# EAGLE design mr_radar_trolley (EAGLE 6.1)
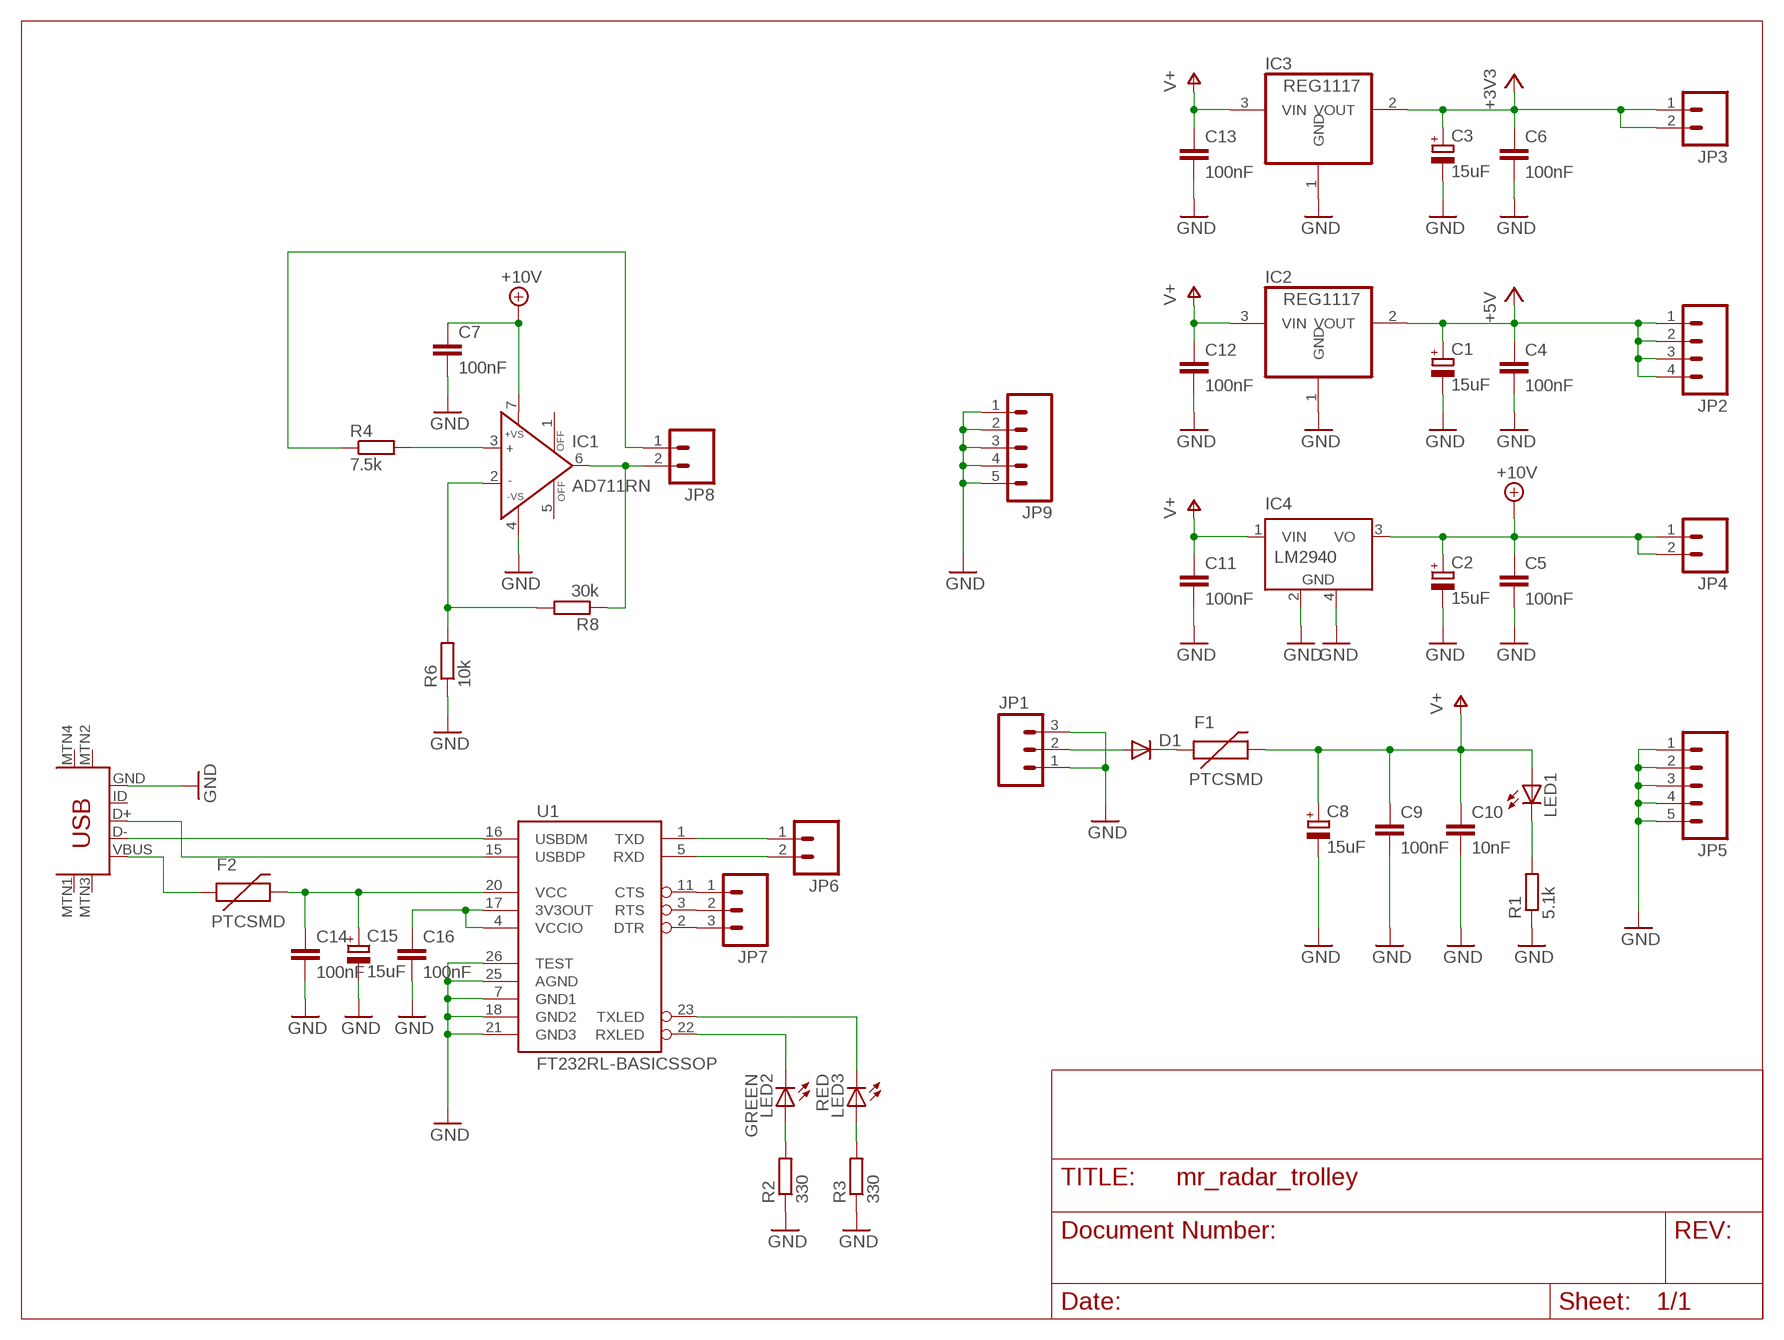
[diagram p0: schematic, sheet 1]

## Parts
C1  15uF  CPOL-EUB/3528-21R  [B/3528-21R]
C2  15uF  CPOL-EUB/3528-21R  [B/3528-21R]
C3  15uF  CPOL-EUB/3528-21R  [B/3528-21R]
C4  100nF  C-EUC0603  [C0603]
C5  100nF  C-EUC0603  [C0603]
C6  100nF  C-EUC0603  [C0603]
C7  100nF  C-EUC0603  [C0603]
C8  15uF  CPOL-EUB/3528-21R  [B/3528-21R]
C9  100nF  C-EUC0603  [C0603]
C10  10nF  C-EUC0603  [C0603]
C11  100nF  C-EUC0603  [C0603]
C12  100nF  C-EUC0603  [C0603]
C13  100nF  C-EUC0603  [C0603]
C14  100nF  C-EUC0603  [C0603]
C15  15uF  CPOL-EUB/3528-21R  [B/3528-21R]
C16  100nF  C-EUC0603  [C0603]
D1  DIODE-SMC  [SMC]
F1  PTCSMD  [PTC-1206]
F2  PTCSMD  [PTC-1206]
IC1  AD711RN  [SO8]
IC2  REG1117  [SOT223]
IC3  REG1117  [SOT223]
IC4  LM2940  LM2936MP-5.0  [SOT223]
JP1  M03SCREW  [SCREWTERMINAL-3.5MM-3]
JP2  M04LOCK  [1X04_LOCK]
JP3  M02PTH  [1X02]
JP4  M02PTH  [1X02]
JP5  M05LOCK  [1X05_LOCK]
JP6  M02PTH  [1X02]
JP7  M03PTH  [1X03]
JP8  M02PTH  [1X02]
JP9  M05LOCK  [1X05_LOCK]
LED1  LEDCHIPLED_1206  [CHIPLED_1206]
LED2  GREEN  LEDCHIPLED_1206  [CHIPLED_1206]
LED3  RED  LEDCHIPLED_1206  [CHIPLED_1206]
R1  5.1k  R-EU_R0603  [R0603]
R2  330  R-EU_M0805  [M0805]
R3  330  R-EU_M0805  [M0805]
R4  7.5k  R-EU_R0603  [R0603]
R6  10k  R-EU_R0603  [R0603]
R8  30k  R-EU_R0603  [R0603]
U1  FT232RL-BASICSSOP  [SSOP28DB]
U$1  USB-MINIB-5PIN  [USB-MINIB]

## Nets
+3V3: C3.+ C6.1 IC3.2(VOUT) JP3.1 JP3.2
+5V: C1.+ C4.1 IC2.2(VOUT) JP2.1 JP2.2 JP2.3 JP2.4
+10V: C2.+ C5.1 C7.1 IC1.7(+VS) IC4.3(VO) JP4.1 JP4.2
GND: C1.- C2.- C3.- C4.2 C5.2 C6.2 C7.2 C8.- C9.2 C10.2 C11.2 C12.2 C13.2 C14.2 C15.- C16.2 IC1.4(-VS) IC2.1(GND) IC3.1(GND) IC4.2(GND) IC4.4(GND) JP1.1 JP1.3 JP5.1 JP5.2 JP5.3 JP5.4 JP5.5 JP9.1 JP9.2 JP9.3 JP9.4 JP9.5 R1.1 R2.1 R3.1 R6.1 U1.7(GND1) U1.18(GND2) U1.21(GND3) U1.25(AGND) U1.26(TEST) U$1.GND
N$1: D1.C F1.1
N$2: D1.A JP1.2
N$3: LED1.C R1.2
N$4: F2.1 U$1.VBUS
N$5: U1.16(USBDM) U$1.D-
N$6: U1.15(USBDP) U$1.D+
N$7: C16.1 U1.4(VCCIO) U1.17(3V3OUT)
N$8: JP6.1 U1.1(TXD)
N$9: JP6.2 U1.5(RXD)
N$10: C14.1 C15.+ F2.2 U1.20(VCC)
N$11: LED3.C U1.23(TXLED)
N$12: LED2.C U1.22(RXLED)
N$13: JP7.1 U1.11(CTS)
N$14: JP7.2 U1.3(RTS)
N$15: JP7.3 U1.2(DTR)
N$16: IC1.2(IN-) R6.2 R8.2
N$17: IC1.6(OUT) JP8.2 R8.1
N$18: JP8.1 R4.1
N$19: IC1.3(IN+) R4.2
V+: C8.+ C9.1 C10.1 C11.1 C12.1 C13.1 F1.2 IC2.3(VIN) IC3.3(VIN) IC4.1(VIN) LED1.A
V+1: LED2.A R2.2
V+2: LED3.A R3.2
Unconnected: IC1.1(OFF) IC1.5(OFF) U$1.ID U$1.MTN1(MTN2) U$1.MTN2(MTN3) U$1.MTN3(MTN1) U$1.MTN4

## Library data of the parts
C1-C3 C8 C15 = rcl:CPOL-EU: POLARIZED CAPACITOR, European symbol
C4-C7 C9-C14 C16 = resistor:C-EU: CAPACITOR, European symbol
D1 = diode:DIODE-: DIODE
F1 F2 = SparkFun-PowerIC:PTC: Resettable Fuse PTC Resettable Fuse. Spark Fun Electronics SKU : COM-08357
IC1 = analog-devices:AD711: Precision, Low Cost, High Speed, BiFET Op Amp Source: http://www.analog.com/static/imported-files/data_sheets/AD711.pdf; MF: ALTERA CORPORATION; MPN: AD711KRZ; OC_FARNELL: 9426396; OC_NEWARK: 59K4541
IC2 IC3 = burr-brown:REG1117: 800mA and 1A Low Dropout (LDO) Positive Regulator 1.8V, 2.5V, 2.85V, 3.3V, 5V, and Adj; MPN: REG1117; OC_FARNELL: 1097566; OC_NEWARK: 14P6981
IC4 = national-semiconductor:LM2936MP?*: Ultra-Low Quiescent Current LDO Voltage Regulator Source: Data sheet <http://www.national.com/ds/LM/LM2936.pdf>; MF: NATIONAL SEMICONDUCTOR; MPN: LM2936MP-5.0/NOPB; OC_FARNELL: 1469063; OC_NEWARK: 41K4524
JP1 JP7 = SparkFun-Connectors:M03: Header 3 Standard 3-pin 0.1" header. Use with straight break away headers (SKU : PRT-00116), right angle break away headers (PRT-00553), swiss pins (PRT-00743), machine pins (PRT-00117), and female headers (PRT-00115). Molex polarized connector foot print use with SKU : PRT-08232 with associated crimp pins and housings.
JP2 = SparkFun-Connectors:M04: Header 4 Standard 4-pin 0.1" header. Use with straight break away headers (SKU : PRT-00116), right angle break away headers (PRT-00553), swiss pins (PRT-00743), machine pins (PRT-00117), and female headers (PRT-00115). Molex polarized connector foot print use with SKU : PRT-08231 with associated crimp pins and housings. 1MM SMD Version SKU: PRT-10208
JP3 JP4 JP6 JP8 = SparkFun-Connectors:M02: Header 2 Standard 2-pin 0.1" header. Use with straight break away headers (SKU : PRT-00116), right angle break away headers (PRT-00553), swiss pins (PRT-00743), machine pins (PRT-00117), and female headers (PRT-00115). Molex polarized connector foot print use with SKU : PRT-08233 with associated crimp pins and housings.
JP5 JP9 = SparkFun-Connectors:M05: Header 5 Standard 5-pin 0.1" header. Use with straight break away headers (SKU : PRT-00116), right angle break away headers (PRT-00553), swiss pins (PRT-00743), machine pins (PRT-00117), and female headers (PRT-00115). Molex polarized connector foot print use with SKU : PRT-08230 with associated crimp pins and housings.
LED1-LED3 = led:LED: LED OSRAM: - CHIPLED LG R971, LG N971, LY N971, LG Q971, LY Q971, LO R971, LY R971 LH N974, LH R974 LS Q976, LO Q976, LY Q976 LO Q996 - Hyper CHIPLED LW Q18S LB Q993, LB Q99A, LB R99A - SideLED LS A670, LO A670, LY A670, LG A670, LP A670 LB A673, LV A673, LT A673, LW A673 LH A674 LY A675 LS A676, LA A676, LO A676, LY A676, LW A676 LS A679, LY A679, LG A679 - Hyper Micro SIDELED® LS Y876, LA Y876, LO Y876, LY Y876 LT Y87S - SmartLED LW L88C, LW L88S LB L89C, LB L89S, LG L890 LS L89K, LO L89K, LY L89K LS L896, LA L896, LO L896, LY L896 - TOPLED LS T670, LO T670, LY T670, LG T670, LP T670 LSG T670, LSP T670, LSY T670, LOP T670, LYG T670 LG T671, LOG T671, LSG T671 LB T673, LV T673, LT T673, LW T673 LH T674 LS T676, LA T676, LO T676, LY T676, LB T676, LH T676, LSB T676, LW T676 LB T67C, LV T67C, LT T67C, LS T67K, LO T67K, LY T67K, LW E67C LS E67B, LA E67B, LO E67B, LY E67B, LB E67C, LV E67C, LT E67C LW T67C LS T679, LY T679, LG T679 LS T770, LO T770, LY T770, LG T770, LP T770 LB T773, LV T773, LT T773, LW T773 LH T774 LS E675, LA E675, LY E675, LS T675 LS T776, LA T776, LO T776, LY T776, LB T776 LHGB T686 LT T68C, LB T68C - Hyper Mini TOPLED® LB M676 - Mini TOPLED Santana® LG M470 LS M47K, LO M47K, LY M47K Source: http://www.osram.convergy.de LUXEON: - LUMILED® LXK2-PW12-R00, LXK2-PW12-S00, LXK2-PW14-U00, LXK2-PW14-V00 LXK2-PM12-R00, LXK2-PM12-S00, LXK2-PM14-U00 LXK2-PE12-Q00, LXK2-PE12-R00, LXK2-PE12-S00, LXK2-PE14-T00, LXK2-PE14-U00 LXK2-PB12-K00, LXK2-PB12-L00, LXK2-PB12-M00, LXK2-PB14-N00, LXK2-PB14-P00, LXK2-PB14-Q00 LXK2-PR12-L00, LXK2-PR12-M00, LXK2-PR14-Q00, LXK2-PR14-R00 LXK2-PD12-Q00, LXK2-PD12-R00, LXK2-PD12-S00 LXK2-PH12-R00, LXK2-PH12-S00 LXK2-PL12-P00, LXK2-PL12-Q00, LXK2-PL12-R00 Source: www.luxeon.com KINGBRIGHT: KA-3528ASYC Source: www.kingbright.com
R1 R4 R6 R8 = rcl:R-EU_: RESISTOR, European symbol
R2 R3 = resistor:R-EU_: RESISTOR, European symbol
U1 = SparkFun-DigitalIC:FT232RL-BASIC: USB UART This is the simplified version of the FT232RL unit. Only what you need, nothing you don't. Spark Fun Electronics SKU : COM-00650
U$1 = SparkFun-Connectors:USB-MINIB: Mini-USB "B" connector with 5th pin broken out. Created new symbol breaking out 5th "ID" pin in mini/micro USB connector spec. See: http://en.wikipedia.org/wiki/Mini_usb#Cables. Uses same footprint as 4-pin symbol. Also added pins to connect to mounting / shield pads if required (probably not generally needed as signals aren't shielded once they leave the connector).

## Board
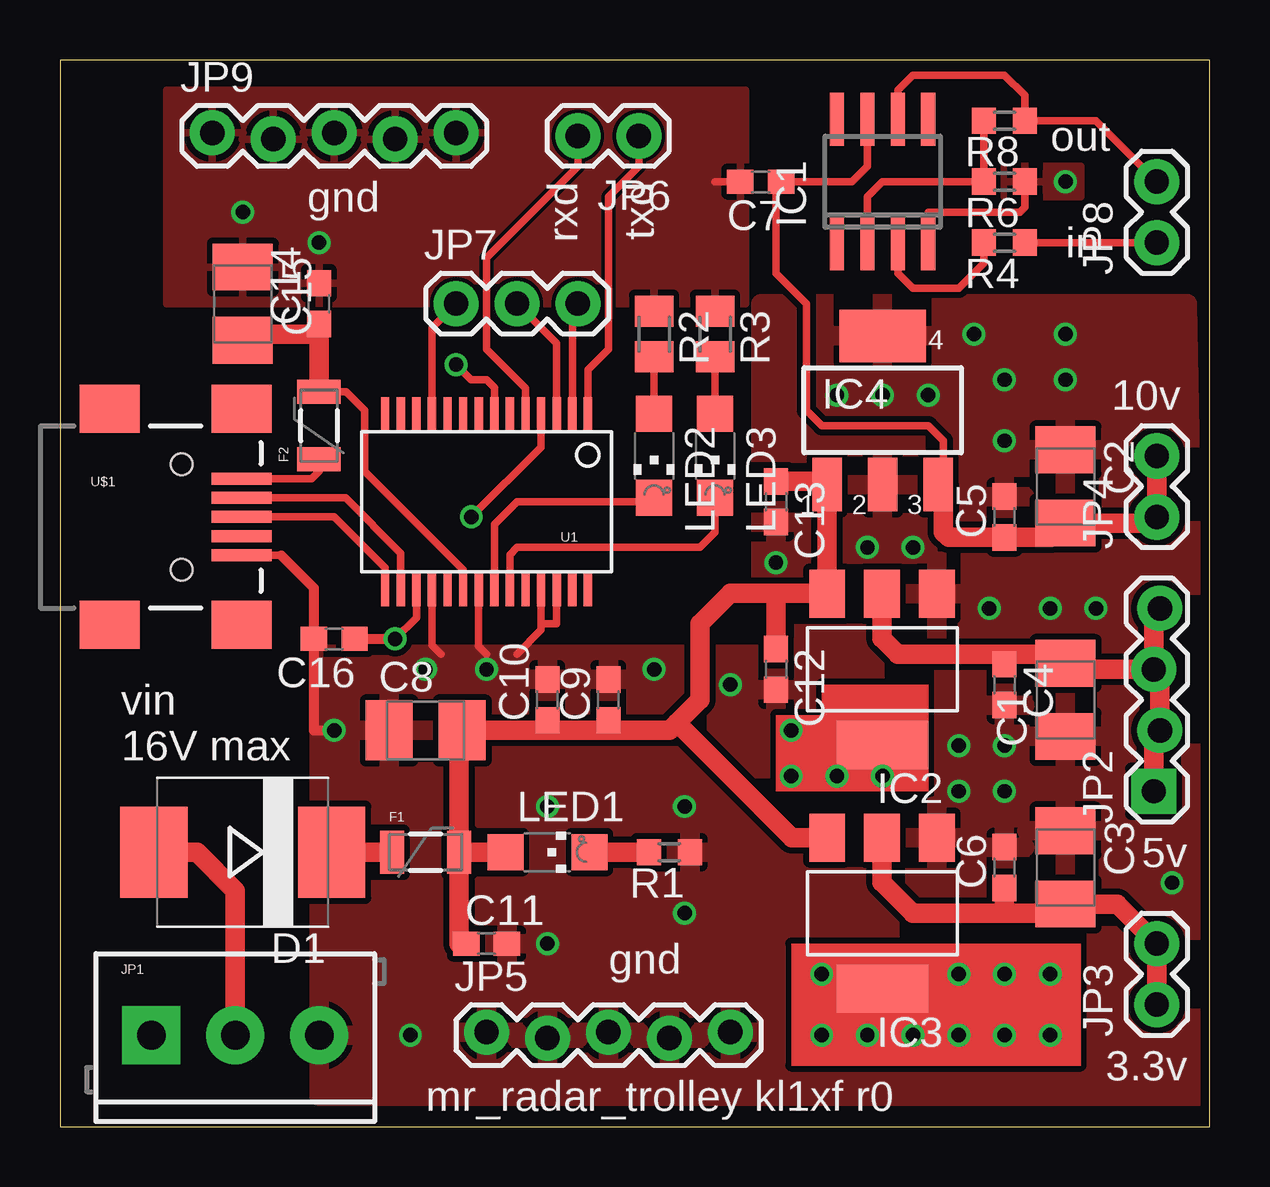
[diagram p1: board, top side]
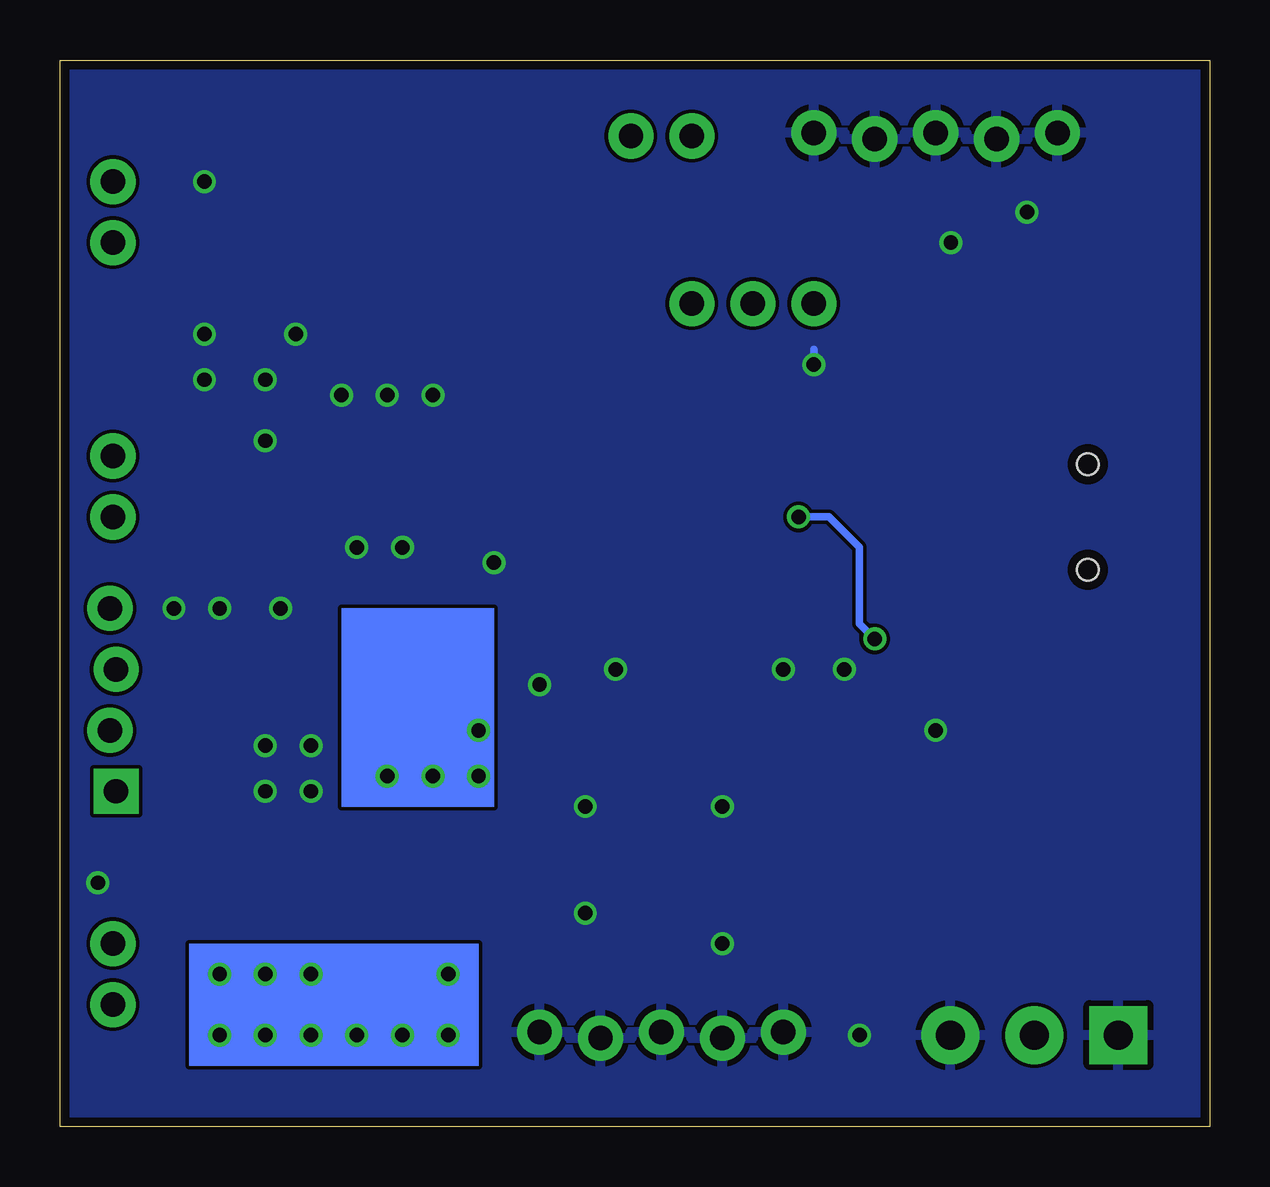
[diagram p2: board, bottom side, seen from below]

Size 47.93 x 44.44 mm. Coordinates in mm from the lower left corner, seen from the top.
Outline: 0,0 47.93,0 47.93,44.44 0,44.44 0,0
Copper layers (1*16): Top 0.0356mm / dielectric 1.5011mm / Bottom 0.0356mm
Design rules: minimum track width 6mil, minimum drill 13mil, track to track 6mil, track to pad 6mil, pad to pad 6mil, via to via 6mil, smd to smd 6mil, copper to edge 15mil, drill to drill 6mil, minimum pad ring 7mil, minimum via ring 7mil, stop-mask expansion 4mil, vias tented up to drill 0mil, thermal gap 10mil

### Footprints (pad centres in the part's own frame; a part is rotated, then mirrored left to right if it is on the bottom)
B/3528-21R = smd 1.95 x 2.5: + 1.525,0; - -1.525,0
C0603 = smd 1.1 x 1: 1 -0.85,0; 2 0.85,0
SMC = smd 2.8 x 3.8: A 3.7,0; C -3.7,0
PTC-1206 = smd 1 x 1.8: 1 -1.4,0; 2 1.4,0
SO8 = smd 0.6 x 2.2: 1 -1.905,-2.6; 2 -0.635,-2.6; 3 0.635,-2.6; 4 1.905,-2.6; 5 1.905,2.6; 6 0.635,2.6; 7 -0.635,2.6; 8 -1.905,2.6
SOT223 = smd 1.499 x 2.007: 1 -2.261,-3.15; 2 0.025,-3.15; 3 2.311,-3.15 | smd 3.81 x 2.007: 4 0,3.15
SOT223' = smd 1.219 x 2.235: 1 -2.311,-3.099; 2 0,-3.099; 3 2.311,-3.099 | smd 3.6 x 2.2: 4 0,3.099
SCREWTERMINAL-3.5MM-3 = drill 1.2 pad 2.413 square: 1 0,0 | drill 1.2 pad 2.413: 2 3.5,0; 3 7,0
1X04_LOCK = drill 1.016 pad 1.88 square: 1 0,0.127 | drill 1.016 pad 1.88: 2 2.54,-0.127; 3 5.08,0.127; 4 7.62,-0.127
1X02 = drill 1.016 pad 1.88: 1 0,0; 2 2.54,0
1X05_LOCK = drill 1.016 pad 1.88: 1 0,0.127; 2 2.54,-0.127; 3 5.08,0.127; 4 7.62,-0.127; 5 10.16,0.127
1X03 = drill 1.016 pad 1.88: 1 0,0; 2 2.54,0; 3 5.08,0
CHIPLED_1206 = smd 1.5 x 1.5: A 0,-1.75; C 0,1.75
R0603 = smd 1 x 1.1: 1 -0.85,0; 2 0.85,0
M0805 = smd 1.3 x 1.6: 1 -0.95,0; 2 0.95,0
SSOP28DB = smd 0.348 x 1.397: 1 -4.225,-3.656; 2 -3.575,-3.656; 3 -2.925,-3.656; 4 -2.275,-3.656; 5 -1.625,-3.656; 6 -0.975,-3.656; 7 -0.325,-3.656; 8 0.325,-3.656; 9 0.975,-3.656; 10 1.625,-3.656; 11 2.275,-3.656; 12 2.925,-3.656; 13 3.575,-3.656; 14 4.225,-3.656; 15 4.225,3.656; 16 3.575,3.656; 17 2.925,3.656; 18 2.275,3.656; 19 1.625,3.656; 20 0.975,3.656; 21 0.325,3.656; 22 -0.325,3.656; 23 -0.975,3.656; 24 -1.625,3.656; 25 -2.275,3.656; 26 -2.925,3.656; 27 -3.575,3.656; 28 -4.225,3.656
USB-MINIB = smd 2.5 x 0.5: D+ 2.5,0; D- 2.5,0.8; GND 2.5,-1.6; ID 2.5,-0.8; VBUS 2.5,1.6 | smd 2.5 x 2: MTN1 -3,4.5; MTN2 2.5,4.5; MTN3 -3,-4.5; MTN4 2.5,-4.5 | hole 0.9: 0,2.2; 0,-2.2

### Placement (x,y rotation side)
C1  41.91,17.78 90 top
C2  41.91,26.67 270 top
C3  41.91,10.79 270 top
C4  39.37,18.41 270 top
C5  39.37,25.4 90 top
C6  39.37,10.79 90 top
C7  29.21,39.37 180 top
C8  15.24,16.51 0 top
C9  22.86,17.78 90 top
C10  20.32,17.78 90 top
C11  17.78,7.62 0 top
C12  29.84,19.05 270 top
C13  29.84,26.04 270 top
C14  10.79,34.29 90 top
C15  7.62,34.29 270 top
C16  11.43,20.32 180 top
D1  7.62,11.43 180 top
F1  15.24,11.43 0 top
F2  10.79,29.21 90 top
IC1  34.29,39.37 0 top
IC2  34.29,19.05 180 top
IC3  34.29,8.89 180 top
IC4  LM2940  [SOT223']  34.29,29.84 0 top
JP1  3.81,3.81 0 top
JP2  45.72,13.97 90 top
JP3  45.72,5.08 90 top
JP4  45.72,25.4 90 top
JP5  17.78,3.81 0 top
JP6  24.13,41.27 180 top
JP7  16.51,34.29 0 top
JP8  45.72,36.83 90 top
JP9  6.35,41.27 0 top
LED1  20.32,11.43 270 top
LED2  24.77,27.94 180 top
LED3  27.3,27.94 180 top
R1  25.4,11.43 180 top
R2  24.77,33.02 270 top
R3  27.3,33.02 270 top
R4  39.37,36.83 180 top
R6  39.37,39.37 180 top
R8  39.37,41.91 180 top
U1  17.78,26.04 180 top
U$1  5.08,25.4 0 top

### Tracks (layer width: path | path; a pad name or v marks a point on that pad's centre or on a via)
+3V3
  Top 0.813: IC3.2 34.27,10.19 35.56,8.89 39.37,8.89 | 39.37,8.89 41.53,8.89 C3.+ 44.07,9.27 JP3.2 JP3.1 | C6.1 39.37,8.89
+5V
  Top 0.813: IC2.2 34.27,20.34 34.92,19.68 39.37,19.68 | 39.37,19.68 41.27,19.68 arc-90 41.91,19.05 | JP2.3 41.91,19.05 | 41.91,19.05 C1.+ | JP2.4 45.59,21.59 JP2.3 | JP2.3 45.85,19.05 JP2.2 45.59,16.51 JP2.1 | C4.1 39.37,19.68
+10V
  Top 0.305: IC4.3 36.83,26.98 36.83,28.57 36.2,29.21 31.75,29.21 31.11,29.84 31.11,34.29 29.84,35.56 29.84,39.37 C7.1 33.02,39.37 33.66,40.01 IC1.7 33.66,42.55
  Top 0.813: JP4.2 JP4.1 45.47,25.14 C2.+ 41.31,24.55 C5.1 37.05,24.55 36.83,24.77 36.83,26.67 36.75,26.75 IC4.3
GND  (via drill 0.6)
  Top 0.305: R6.1 40.22,38.31 40.01,38.1 36.2,38.1 IC1.4 | C7.2 27.3,39.37 | U$1.GND 9.22,23.8 | U1.25 20.05,20.95 | 20.05,20.95 20.05,20.69 19.05,19.68 | U1.21 17.45,20.01 17.78,19.68 | U1.18 15.51,20.05 15.88,19.68 | U1.7 18.11,30.79 17.78,31.11 17.14,31.11 v16.51,31.75 | U1.26 20.7,20.95 20.05,20.95
  Top 0.406: 9.22,23.8 10.58,22.44 C16.2 10.58,16.51 v11.43,16.51
  Bottom 0.305: v16.51,31.75 16.51,32.38
  other vias: 27.94,18.41 37.47,15.88 39.37,15.88 39.37,13.97 37.47,13.97 38.73,21.59 41.27,21.59 43.18,21.59 39.37,28.57 39.37,31.11 41.91,31.11 32.38,30.48 34.29,30.48 36.2,30.48 29.84,23.5 41.91,39.37 33.66,24.13 35.56,24.13 24.77,19.05 17.78,19.05 15.24,19.05 10.79,36.83 7.62,38.1 46.35,10.16 26.04,13.34 26.04,8.89 20.32,7.62 14.61,3.81 20.32,13.34 38.1,33.02 41.91,33.02
  pour Bottom: 0,53.34 0,0 71.12,0 71.12,53.34 5.08,53.34
  pour Top (isolate 0.254): 10.79,19.68 10.79,1.27 47.62,1.27 46.99,34.29 29.21,34.29 29.21,19.68
  pour Top: 42.55,40.01 42.55,38.73 39.37,38.73 39.37,40.01
  pour Top: 4.45,43.18 28.57,43.18 28.57,34.29 4.45,34.29
N$1
  Top 0.813: D1.C F1.1
N$2
  Top 0.813: JP1.2 7.31,9.84 5.71,11.43 D1.A
N$3
  Top 0.813: LED1.C R1.2
N$4
  Top 0.305: U$1.VBUS 10.49,27 10.79,27.3 F2.1 10.79,27.94
N$5
  Top 0.305: U1.16 14.21,23.89 11.9,26.2 U$1.D-
N$6
  Top 0.305: U$1.D+ 11.43,25.4 13.55,23.27 U1.15
N$7  (via drill 0.6)
  Top 0.305: U1.4 20.05,28.31 v17.14,25.4 | v13.97,20.32 14.86,21.2 U1.17
  Top 0.406: C16.1 v13.97,20.32
  Bottom 0.305: v17.14,25.4 15.88,25.4 14.61,24.13 14.61,20.95 v13.97,20.32
N$8
  Top 0.305: U1.1 22,31.53 22.86,32.38 22.86,38.73 24.13,40.01 JP6.1
N$9
  Top 0.305: U1.5 19.41,30.76 17.78,32.38 17.78,36.2 21.59,40.01 JP6.2
N$10
  Top 0.305: F2.2 11.94,30.61 12.7,29.84 12.7,27.3 16.8,23.2 U1.20
  Top 0.813: C15.+ 7.88,33.02 10.79,33.02 | F2.2 10.79,33.02 | 10.79,33.02 C14.1
N$11
  Top 0.305: U1.23 18.75,23.84 19.05,24.13 26.67,24.13 27.3,24.77 LED3.C
N$12
  Top 0.305: U1.22 18.11,25.09 19.05,26.04 24.61,26.04 LED2.C
N$13
  Top 0.305: U1.11 15.51,33.28 JP7.1
N$14
  Top 0.305: U1.3 20.7,32.63 JP7.2
N$15
  Top 0.305: U1.2 21.36,34.05 JP7.3
N$16
  Top 0.305: IC1.2 33.66,38.73 34.29,39.37 R6.2 | R6.2 R8.2 | R6.2 38.73,39.37
N$17
  Top 0.305: IC1.6 34.92,43.18 35.56,43.81 39.37,43.81 40.22,42.97 R8.1 43.18,41.91 JP8.2
N$18
  Top 0.305: JP8.1 R4.1
N$19
  Top 0.305: IC1.3 34.92,35.56 35.56,34.92 37.47,34.92 38.52,35.98 R4.2
N$20  (via drill 0.6)
  other vias: 31.75,6.35
N$21  (via drill 0.6)
  other vias: 31.75,3.81
N$22  (via drill 0.6)
  other vias: 33.66,3.81
N$23  (via drill 0.6)
  other vias: 35.56,3.81
N$24  (via drill 0.6)
  other vias: 37.47,3.81
N$25  (via drill 0.6)
  other vias: 37.47,6.35
N$26  (via drill 0.6)
  other vias: 39.37,6.35
N$27  (via drill 0.6)
  other vias: 41.27,6.35
N$28  (via drill 0.6)
  other vias: 41.27,3.81
N$29  (via drill 0.6)
  other vias: 39.37,3.81
N$30  (via drill 0.6)
  other vias: 30.48,16.51
N$31  (via drill 0.6)
  other vias: 30.48,14.61
N$32  (via drill 0.6)
  other vias: 32.38,14.61
N$33  (via drill 0.6)
  other vias: 34.29,14.61
V+
  Top 0.61: 16.64,16.39 C8.+ | 31.95,22.23 IC2.3 | 31.84,26.89 IC4.1
  Top 0.813: F1.2 LED1.A | F1.2 16.64,16.39 | C8.+ 20.32,16.51 | 20.32,16.51 22.86,16.51 | 22.86,16.51 25.4,16.51 25.72,16.83 | 25.72,16.83 26.67,17.78 26.67,20.95 27.94,22.23 29.84,22.23 | 29.84,22.23 31.95,22.23 | IC4.1 IC2.3 | C13.1 31.84,26.89 | C12.1 29.84,22.23 | 25.72,16.83 30.5,12.04 IC3.3 | C9.1 22.86,16.51 | C10.1 20.32,16.51 | F1.2 16.64,7.62 C11.1
V+1
  Top 0.305: LED2.A R2.2
V+2
  Top 0.305: R3.2 LED3.A
(copper drawn outside any net)
  shapes: Bottom area x4, Top area x3

### Text on the board
_tsilk: out | gnd | rxd | txd | in | 10v | vin | 16V max | 5v | gnd | 3.3v | mr_radar_trolley kl1xf r0